# Altium schematic sheet Power input.SchDoc: Name project title here
size A3; Organization: Krakul OÜ; Address1: Kaare tee 3, lubja; Address2: viimsi vald; Address3: harju maakond; Address4: Estonia 74010; DocumentNumber: No here; Revision: 0; SheetNumber: 4; SheetTotal: 7
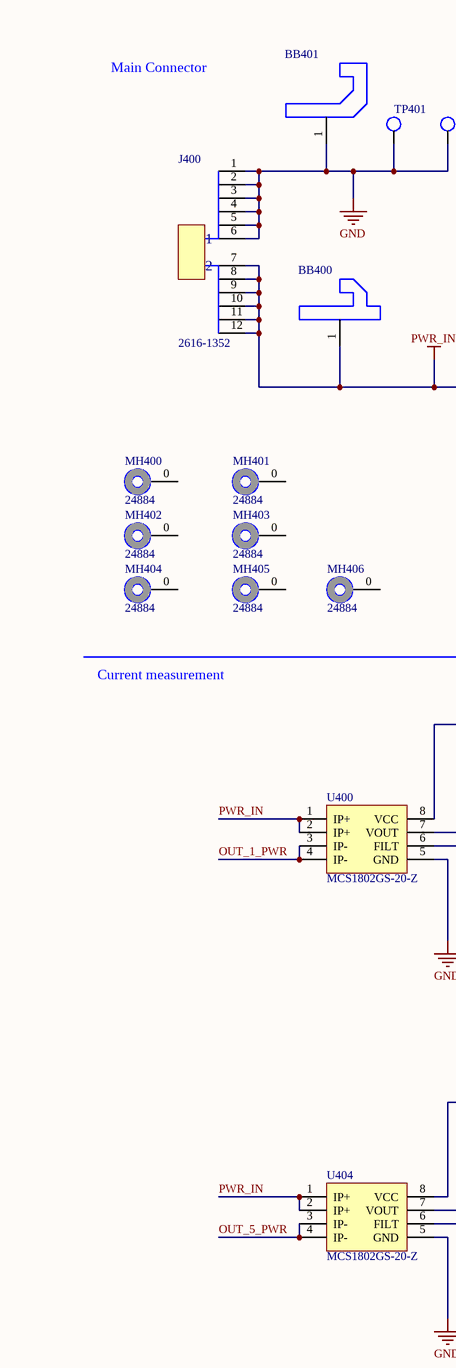
[diagram p0: Power input.SchDoc, left]
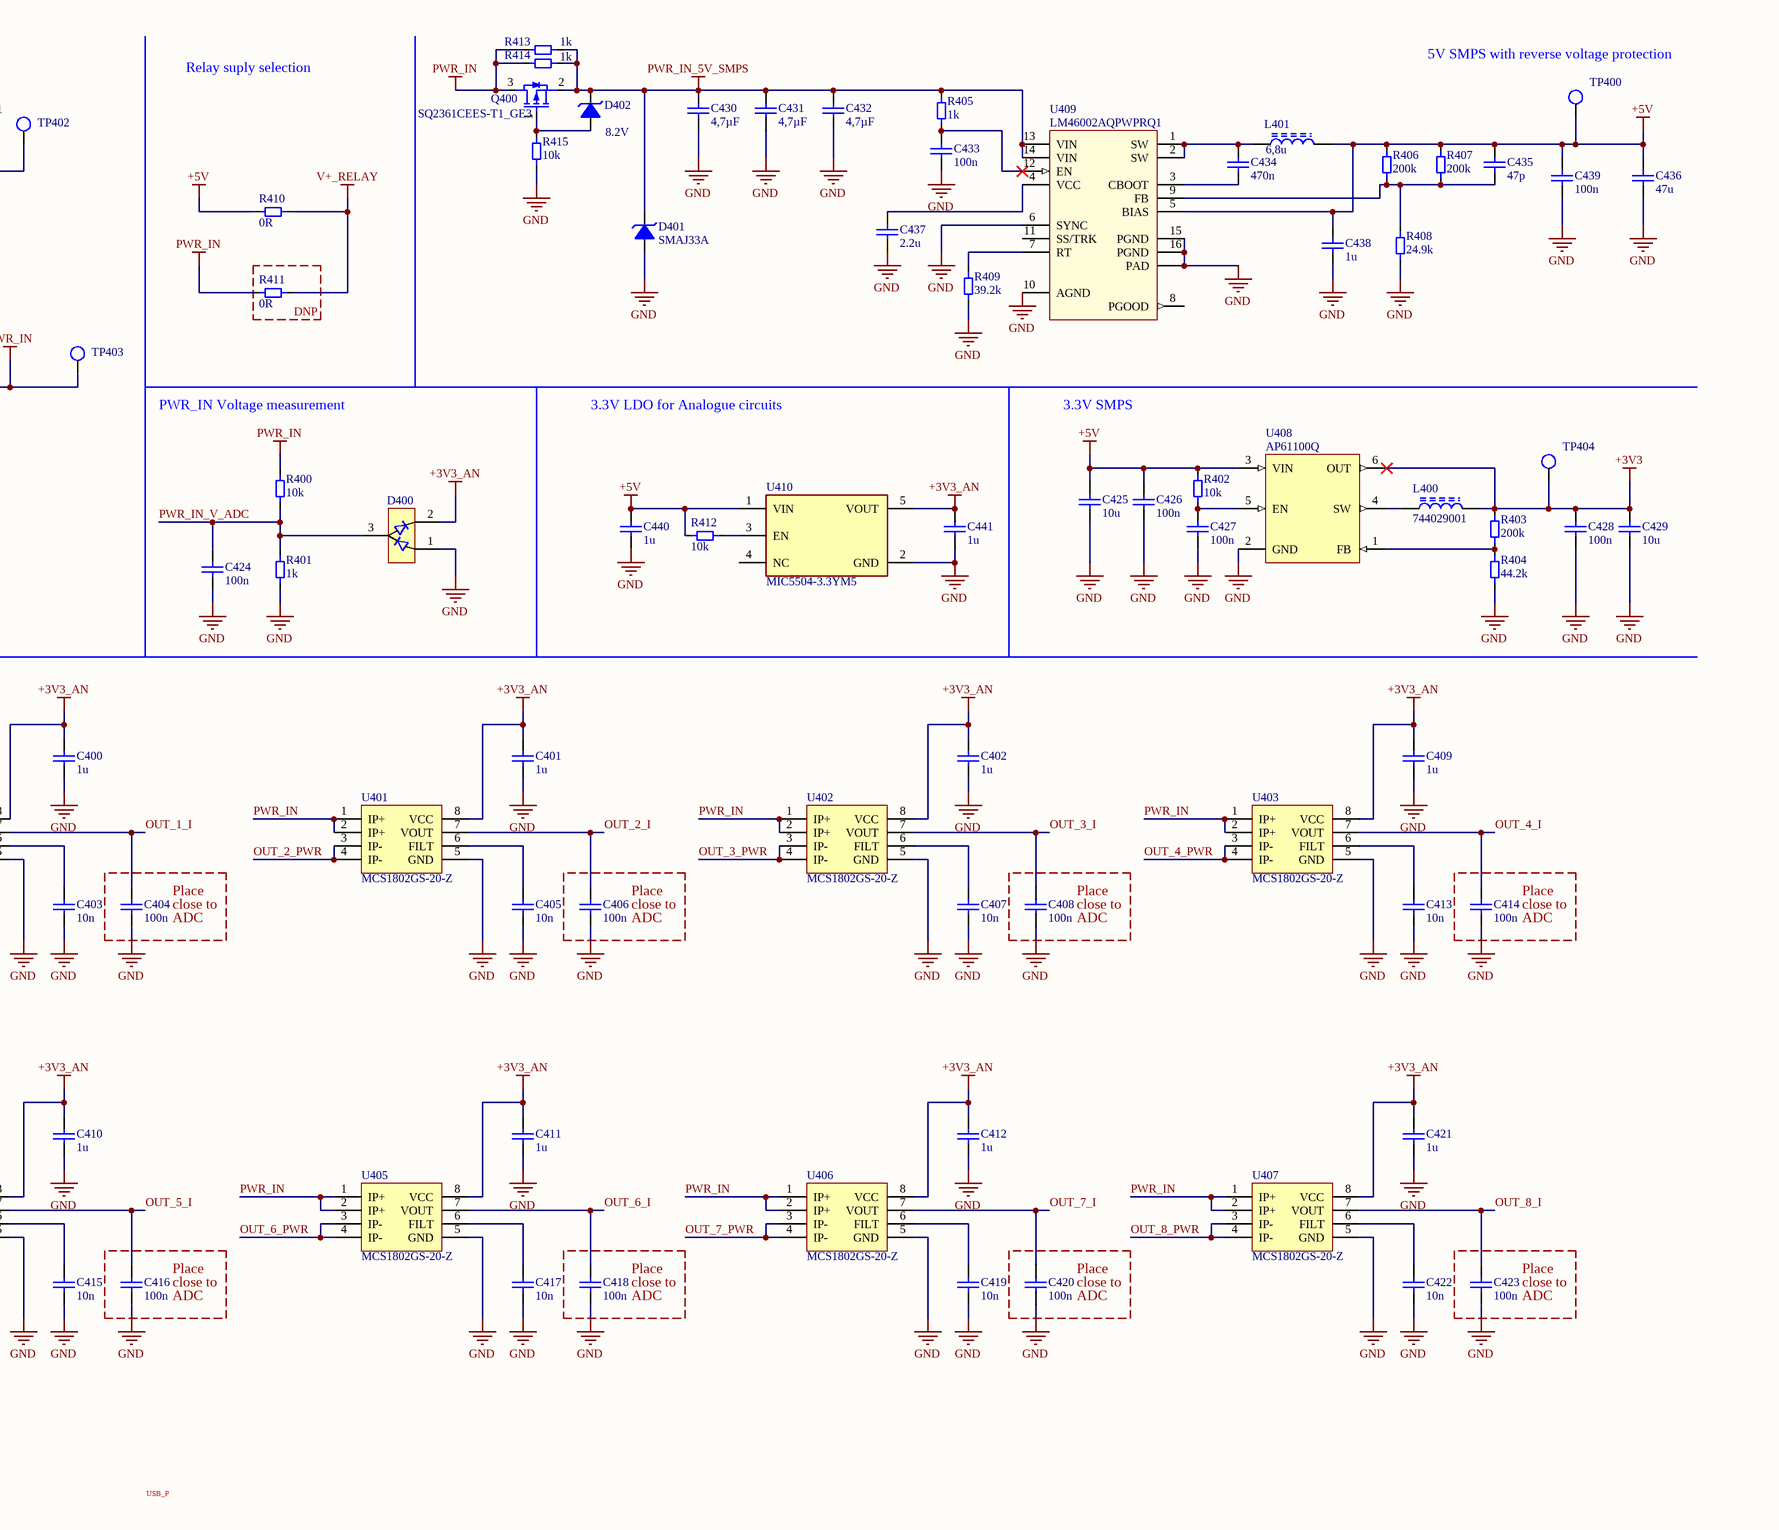
[diagram p1: Power input.SchDoc, right]

## Parts
BB400  Kr-Df-01 PWR BUSBAR  [Kr-Df-01 PWR BUSBAR footprint]  (value not drawn)
BB401  KR-Df-01 GND BUSBAR  [KR-Df-01 GND BUSBAR-Footprint-1]  (value not drawn)
C400  1u  [MLCC_0603_M]
C401  1u  [MLCC_0603_M]
C402  1u  [MLCC_0603_M]
C403  10n  [MLCC_0402_M]
C404  100n  [MLCC_0402_M]
C405  10n  [MLCC_0402_M]
C406  100n  [MLCC_0402_M]
C407  10n  [MLCC_0402_M]
C408  100n  [MLCC_0402_M]
C409  1u  [MLCC_0603_M]
C410  1u  [MLCC_0603_M]
C411  1u  [MLCC_0603_M]
C412  1u  [MLCC_0603_M]
C413  10n  [MLCC_0402_M]
C414  100n  [MLCC_0402_M]
C415  10n  [MLCC_0402_M]
C416  100n  [MLCC_0402_M]
C417  10n  [MLCC_0402_M]
C418  100n  [MLCC_0402_M]
C419  10n  [MLCC_0402_M]
C420  100n  [MLCC_0402_M]
C421  1u  [MLCC_0603_M]
C422  10n  [MLCC_0402_M]
C423  100n  [MLCC_0402_M]
C424  100n  [MLCC_0402_M]
C425  10u  [MLCC_0603_M]
C426  100n  [MLCC_0402_M]
C427  100n  [MLCC_0402_M]
C428  100n  [MLCC_0402_M]
C429  10u  [MLCC_0603_M]
C430  value 4,7µF  [MLCC_1210_M]  (hidden comment: 4.7u)
C431  value 4,7µF  [MLCC_1210_M]  (hidden comment: 4.7u)
C432  value 4,7µF  [MLCC_1210_M]  (hidden comment: 4.7u)
C433  100n  [MLCC_0402_M]
C434  470n  [MLCC_0402_M]
C435  47p  [MLCC_0402_M]
C436  47u  [MLCC_1206_M]
C437  2.2u  [MLCC_0603_M]
C438  1u  [MLCC_0603_M]
C439  100n  [MLCC_0402_M]
C440  1u  [MLCC_0603_M]
C441  1u  [MLCC_0603_M]
D400  BAT6404WH6327XTSA1  [SOT323, SC70]  (value not drawn)
D401  SMAJ33A  [FP-SMAJ-MFG]
D402  Zener Voltage: 8.2V  [SOD-323]  (hidden comment: MM3Z8V2ST1G)
J400  2616-1352  [2616-1352-Footprint-1]
L400  744029001  [744029001]
L401  value 6,8u  [SRP0420-6R8K-Footprint-1]  (hidden comment: SRP0420-6R8K)
MH400  24884  [24884-Footprint-1]
MH401  24884  [24884-Footprint-1]
MH402  24884  [24884-Footprint-1]
MH403  24884  [24884-Footprint-1]
MH404  24884  [24884-Footprint-1]
MH405  24884  [24884-Footprint-1]
MH406  24884  [24884-Footprint-1]
Q400  SQ2361CEES-T1_GE3  [3-CPH]
R400  10k  [Resistor_0603_M]
R401  1k  [Resistor_0603_M]
R402  10k  [Resistor_0603_M]
R403  200k  [Resistor_0603_M]
R404  44.2k  [Resistor_0603_M]
R405  1k  [Resistor_0402_M]
R406  200k  [Resistor_0603_M]
R407  200k  [Resistor_0603_M]
R408  24.9k  [Resistor_0402_M]
R409  39.2k  [Resistor_0402_M]
R410  Value 2: 0R  [TLRZ2BTTD-Footprint-1]  (hidden comment: TLRZ2BTTD)
R411  Value 2: 0R  [TLRZ2BTTD-Footprint-1]  (hidden comment: TLRZ2BTTD)
R412  10k  [Resistor_0603_M]
R413  1k  [Resistor_0402_M]
R414  1k  [Resistor_0402_M]
R415  10k  [Resistor_0603_M]
TP400  Testpoint 1mm  [Testpoint 1mm]  (value not drawn)  (no BOM)
TP401  Testpoint 1mm  [Testpoint 1mm]  (value not drawn)  (no BOM)
TP402  Testpoint 1mm  [Testpoint 1mm]  (value not drawn)  (no BOM)
TP403  Testpoint 1mm  [Testpoint 1mm]  (value not drawn)  (no BOM)
TP404  Testpoint 1mm  [Testpoint 1mm]  (value not drawn)  (no BOM)
U400  MCS1802GS-20-Z  [MCS1802GS-20-Z -Footprint-1]
U401  MCS1802GS-20-Z  [MCS1802GS-20-Z -Footprint-1]
U402  MCS1802GS-20-Z  [MCS1802GS-20-Z -Footprint-1]
U403  MCS1802GS-20-Z  [MCS1802GS-20-Z -Footprint-1]
U404  MCS1802GS-20-Z  [MCS1802GS-20-Z -Footprint-1]
U405  MCS1802GS-20-Z  [MCS1802GS-20-Z -Footprint-1]
U406  MCS1802GS-20-Z  [MCS1802GS-20-Z -Footprint-1]
U407  MCS1802GS-20-Z  [MCS1802GS-20-Z -Footprint-1]
U408  AP61100Q  [SOT-5X3]
U409  LM46002AQPWPRQ1  [HTSSOP-16]
U410  MIC5504-3.3YM5  [FP-SOT23-5LD-PL-1-IPC_A]

## Blocks framed on the sheet
DNP: R411

## Nets
+3V3: C428.2 C429.2 L400.2 R403.2 TP404.1 U408.6(OUT)
+3V3_AN: C400.2 C401.2 C402.2 C409.2 C410.2 C411.2 C412.2 C421.2 C441.2 D400.2 U400.8(VCC) U401.8(VCC) U402.8(VCC) U403.8(VCC) U404.8(VCC) U405.8(VCC) U406.8(VCC) U407.8(VCC) U410.5(VOUT)
+5V: C425.2 C426.2 C435.2 C436.2 C438.2 C439.2 C440.2 L401.2 R402.2 R406.2 R407.2 R410.2 R412.2 TP400.1 U408.3(VIN) U409.5(BIAS) U410.1(VIN)
GND: BB401.1(GND) C400.1 C401.1 C402.1 C403.1 C404.1 C405.1 C406.1 C407.1 C408.1 C409.1 C410.1 C411.1 C412.1 C413.1 C414.1 C415.1 C416.1 C417.1 C418.1 C419.1 C420.1 C421.1 C422.1 C423.1 C424.1 C425.1 C426.1 C427.1 C428.1 C429.1 C430.2 C431.2 C432.2 C433.2 C436.1 C437.1 C438.1 C439.1 C440.1 C441.1 D400.1 D401.2(A) J400.1 J400.2 J400.3 J400.4 J400.5 J400.6 R401.1 R404.1 R408.1 R409.1 R415.1 TP401.1 TP402.1 U400.5(GND) U401.5(GND) U402.5(GND) U403.5(GND) U404.5(GND) U405.5(GND) U406.5(GND) U407.5(GND) U408.2(GND) U409.6(SYNC) U409.10(AGND) U409.15(PGND) U409.16(PGND) U409.17(PAD) U410.2(GND)
PWR_IN: BB400.1 J400.7 J400.8 J400.9 J400.10 J400.11 J400.12 Q400.3(D) R400.2 R411.2 R413.2 R414.2 TP403.1 U400.1(IP+) U400.2(IP+) U401.1(IP+) U401.2(IP+) U402.1(IP+) U402.2(IP+) U403.1(IP+) U403.2(IP+) U404.1(IP+) U404.2(IP+) U405.1(IP+) U405.2(IP+) U406.1(IP+) U406.2(IP+) U407.1(IP+) U407.2(IP+)
PWR_IN_5V_SMPS: C430.1 C431.1 C432.1 D401.1(C) D402.1(C) Q400.2(S) R405.2 R413.1 R414.1 U409.13(VIN) U409.14(VIN)
V+_RELAY: R410.1 R411.1
OUT_1_I: C404.2 U400.7(VOUT)
OUT_1_PWR: U400.3(IP-) U400.4(IP-)
OUT_2_I: C406.2 U401.7(VOUT)
OUT_2_PWR: U401.3(IP-) U401.4(IP-)
OUT_3_I: C408.2 U402.7(VOUT)
OUT_3_PWR: U402.3(IP-) U402.4(IP-)
OUT_4_I: C414.2 U403.7(VOUT)
OUT_4_PWR: U403.3(IP-) U403.4(IP-)
OUT_5_I: C416.2 U404.7(VOUT)
OUT_5_PWR: U404.3(IP-) U404.4(IP-)
OUT_6_I: C418.2 U405.7(VOUT)
OUT_6_PWR: U405.3(IP-) U405.4(IP-)
OUT_7_I: C420.2 U406.7(VOUT)
OUT_7_PWR: U406.3(IP-) U406.4(IP-)
OUT_8_I: C423.2 U407.7(VOUT)
OUT_8_PWR: U407.3(IP-) U407.4(IP-)
PWR_IN_V_ADC: C424.2 D400.3 R400.1 R401.2
NetC403_2: C403.2 U400.6(FILT)
NetC405_2: C405.2 U401.6(FILT)
NetC407_2: C407.2 U402.6(FILT)
NetC413_2: C413.2 U403.6(FILT)
NetC415_2: C415.2 U404.6(FILT)
NetC417_2: C417.2 U405.6(FILT)
NetC419_2: C419.2 U406.6(FILT)
NetC422_2: C422.2 U407.6(FILT)
NetC427_2: C427.2 R402.1 U408.5(EN)
NetC433_1: C433.1 R405.1 U409.12(EN)
NetC434_1: C434.1 U409.3(CBOOT)
NetC434_2: C434.2 L401.1 U409.1(SW) U409.2(SW)
NetC435_1: C435.1 R406.1 R407.1 R408.2 U409.9(FB)
NetC437_2: C437.2 U409.4(VCC)
NetD402_2: D402.2(A) Q400.1(G) R415.2
NetL400_1: L400.1 U408.4(SW)
NetR403_1: R403.1 R404.2 U408.1(FB)
NetR409_2: R409.2 U409.7(RT)
NetR412_1: R412.1 U410.3(EN)

Not connected (* = marked no-connect by the designer): MH400 0(MH?); MH401 0(MH?); MH402 0(MH?); MH403 0(MH?); MH404 0(MH?); MH405 0(MH?); MH406 0(MH?); U409 8(PGOOD) 11(SS/TRK); U410 4(NC)

## Notes on the sheet
- Main Connector
- Relay suply selection
- (near TP400) 5V SMPS with reverse voltage protection
- PWR_IN Voltage measurement
- 3.3V LDO for Analogue circuits
- 3.3V SMPS
- Current measurement
- (near C404) Place
- (near C404) close to
- (near C404) ADC
- (near C406) Place
- (near C406) close to
- (near C406) ADC
- (near C408) Place
- (near C408) close to
- (near C408) ADC
- (near C414) Place
- (near C414) close to
- (near C414) ADC
- (near C416) Place
- (near C416) close to
- (near C416) ADC
- (near C418) Place
- (near C418) close to
- (near C418) ADC
- (near C420) Place
- (near C420) close to
- (near C420) ADC
- (near C423) Place
- (near C423) close to
- (near C423) ADC
- USB_P
- Title:
- Date:
- Last modified:
- Project:
- Sheet
- Time:
- of
- Size:
- A3
- Engineer:
- Revision:
- Revision date:
- Checked by:

## Library data of the parts
BB400 = CMP-ROOT-01072-9: Custom PWR busbar for DefSecIntel fuse board.; Manufacturer: Krakul; Part number: PWR_BUSBAR_1; Case/Package: Custom busbar; Mount: SMD; Pins: 1; RoHS: Yes
BB401 = CMP-ROOT-01092-5: Custom GND busbar for DefSecIntel fuse board; Manufacturer: Krakul; Part number: GND_BUSBAR_1; Case/Package: Custom busbar; Mount: SMD; Pins: 1; RoHS: Yes
C400-C402 C409-C412 C421 C438 C440 C441 = CMP-001-0642-2: MLCC, 0603, 1u, 10%, 10V, X7R; Manufacturer: Any; Capacitor Type: Ceramic; Value: 1µF; Mount: SMD; Tolerance: 10%; Case/Package: 0603; Part number: MLCC, 0603, 1u, 10%, 10V, X7R; RoHS: Yes; Voltage: 10V; Dielectric: X7R
C403 C405 C407 C413 C415 C417 C419 C422 = CMP-0001-00209-2: MLCC, 0402, 10n, 10%, 50V, X5R; Manufacturer: Any; Value: 10nF; Capacitor Type: Ceramic; Dielectric: X5R; Case/Package: 0402; Mount: SMD; Voltage: 50V; Part number: MLCC, 0402, 10n, 10%, 50V, X5R; Tolerance: 10%; RoHS: Yes
C404 C406 C408 C414 C416 C418 C420 C423 C424 C426-C428 C439 = CMP-001-1256-2: MLCC, 0402, 100n, 10%, 10V, X5R; Manufacturer: Any; Capacitor Type: Ceramic; Value: 100nF; Case/Package: 0402; Part number: MLCC, 0402, 100n, 10%, 10V, X5R; RoHS: Yes; Tolerance: 10%; Mount: SMD; Voltage: 10V; Dielectric: X5R
C425 C429 = CMP-001-1355-1: MLCC, 0603, 10u, 10%, 25V, X5R; Manufacturer: Any; Value: 10µF; Capacitor Type: Ceramic; Voltage: 25V; Dielectric: X5R; Case/Package: 0603; Part number: MLCC, 0603, 10u, 10%, 25V, X5R; RoHS: Yes; Mount: SMD
C430-C432 = CMP-001-1296-1: MLCC, 1210, 4.7u, 10%, 100V, X7S; Manufacturer: Any; Capacitor Type: Ceramic; Capacitance: 4.7uF; Voltage Rating: 100V; Case Code (Metric): 3225; Case/Package: 1210; Min Operating Temperature: -55°C; Voltage: 100V; Mount: Surface Mount; Tolerance: 10%; Part number: MLCC, 1210, 4.7u, 10%, 100V, X7S; Packaging: Tape and Reel; Case Code (Imperial): 1210; RoHS: Yes; Dielectric: X7S; Max Operating Temperature: 125°C
C433 = CMP-0001-00196-2: MLCC, 0402, 100n, 10%, 50V, X7R; Manufacturer: Any; Value: 100nF; Capacitor Type: Ceramic; Part number: MLCC, 0402, 100n, 10%, 50V, X7R; Mount: SMD; Voltage: 50V; RoHS: Yes; Dielectric: X7R; Tolerance: 10%; Case/Package: 0402
C434 = CMP-0001-00217-2: MLCC, 0402, 470n, 10%, 50V, X5R; Manufacturer: Any; Capacitor Type: Ceramic; Value: 470nF; Dielectric: X5R; Mount: SMD; RoHS: Yes; Case/Package: 0402; Part number: MLCC, 0402, 470n, 10%, 50V, X5R; Voltage: 50V; Tolerance: 10%
C435 = CMP-0001-00149-2: MLCC, 0402, 47p, 10%, 50V, X7R; Manufacturer: Any; Capacitor Type: Ceramic; Value: 47pF; Tolerance: 10%; Case/Package: 0402; Dielectric: X7R; Mount: SMD; Voltage: 50V; RoHS: Yes; Part number: MLCC, 0402, 47p, 10%, 50V, X7R
C436 = CMP-001-1106-2: MLCC, 1206, 47u, 10%, 10V, X5R; Manufacturer: Any; Value: 47µF; Capacitor Type: Ceramic; Dielectric: X5R; Mount: SMD; Part number: MLCC, 1206, 47u, 10%, 10V, X5R; Tolerance: 10%; RoHS: Yes; Case/Package: 1206; Voltage: 10V
C437 = CMP-001-1459-1: MLCC, 0603, 2.2u, 10%, 16V, X5R; Manufacturer: Any; Capacitor Type: Ceramic; Value: 2.2µF; RoHS: Yes; Dielectric: X5R; Part number: MLCC, 0603, 2.2u, 10%, 16V, X5R; Case/Package: 0603; Tolerance: 10%; Voltage: 16V; Mount: SMD
D400 = CMP-ROOT-00071-1: Diode Array 1 Pair Series Connection Schottky 40V 120mA Surface Mount SC-70, SOT-323; Manufacturer: Infineon; Peak Non-Repetitive Surge Current: 800mA; Forward Current: 250mA; Forward Voltage: 750mV; Reverse Recovery Time: 5ns; RoHS: Yes; Radiation Hardening: No; Halogen Free: Halogen Free; Case/Package: SOT-323; Number of Pins: 3; Max Reverse Voltage (DC): 40V; Max Repetitive Reverse Voltage (Vrrm): 40V; Mount: Surface Mount; Average Rectified Current: 120mA; Max Operating Temperature: 150°C; Lead Free: Lead Free; Min Operating Temperature: -55°C; Part number: BAT6404WH6327XTSA1; Packaging: Tape and Reel; Pins: 3
D401 = CMP-ROOT-01076-1: SMAJ Series 53.3 V 0.4 kW Surface Mount Uni-Directional TVS Diode - DO-214AC; Manufacturer: Littelfuse; Clamping Voltage: 53.3V; Diode Type: ZENER; Direction: Unidirectional; Leakage Current: 1uA; Max Breakdown Voltage: 40.6V; Max Power Dissipation: 3.3W; Min Breakdown Voltage: 36.7V; Number of Elements: 1; Peak Pulse Current: 7.5A; Peak Pulse Power: 400W; Power Line Protection: No; Reverse Standoff Voltage: 33V; Test Current: 1mA; Case/Package: DO-214AC; Mount: SMD; Part number: SMAJ33A; Pins: 2; RoHS: Yes; Clamping Voltage-Max: 53.3V; Height: 2.087mm; Lead Free: Lead Free; Length: 4.5mm; Max Operating Temperature: 150°C; Max Reverse Leakage Current: 1uA; Min Operating Temperature: -65°C; Mounting Technology: Surface Mount; Number of Unidirectional Channels: 1; Packaging: Tape and Reel; Polarity: Unidirectional; Power Dissipation: 400W; Reach SVHC Compliant: Unknown; Reverse Breakdown Voltage: 36.7V; RoHS Compliant: Yes; Series: SMAJ; Voltage Rating (DC): 33V; Width: 2.79mm
D402 = CMP-ROOT-00931-1: MM3Z8V2ST1 Series 200 mW 10 mA 8.2 V SMT Zener Voltage Regulator - SOD-323; Manufacturer: onsemi; Element Configuration: Single; Forward Voltage: 900mV; Impedance: 15R; Material: Plastic; Max Power Dissipation: 200mW; Max Reverse Current: 700nA; Test Current: 5mA; Tolerance: 2%; Zener Current: 10mA; Case/Package: SOD-323-2; Mount: SMD; Part number: MM3Z8V2ST1G; RoHS: Yes; Height: 1mm; Lead Free: Lead Free; Length: 1.8mm; Max Operating Temperature: 150°C; Max Reverse Leakage Current: 700nA; Min Operating Temperature: -65°C; Number of Pins: 2; Package Quantity: 3000; Packaging: Tape and Reel; Power Dissipation: 200mW; Power Rating: 200mW; Radiation Hardening: No; Reach SVHC Compliant: Yes; RoHS Compliant: Yes; Series: -; Voltage Rating (DC): 8.2V; Voltage Tolerance: 2%; Width: 1.35mm; Working Voltage: 8.2V
J400 = CMP-ROOT-01061-1: Lever actuated terminal block, Wire-to-board. 78A, 300V, 4-18 AWG; Manufacturer: WAGO; Mount: TH; Part number: 2616-1352; Pins: 2; RoHS: Yes; Housing Color: Grey
L400 = CMP-ROOT-00305-1: 1µH Shielded Wirewound Inductor 2.2A 55mOhm Max Nonstandard; Manufacturer: Wurth Electronics Inc.; DC Resistance (DCR): 55mR; Inductance: 1uH; Value: 1uH; Test Frequency: 100kHz; Inductance Tolerance: 30%; Saturation Current: 1.6A; Self Resonant Frequency: 150MHz; Core Material: Ferrite; Max DC Current: 2.5A; RoHS: Yes; Number of Pins: 2; Width: 2.8mm; Height: 1.35mm; Length: 2.8mm; Current Rating: 2.2A; Termination: SMD/SMT; Packaging: Cut Tape; Height - Seated (Max): 0.059inch; Part number: 744029001; Composition: Wirewound; Case/Package: Nonstandard; Depth: 2.8mm; Mount: Surface Mount; REACH SVHC: Unknown; RMS Current (Irms): 2.2A; Package Quantity: 1200; Weight: 0.001129oz; Max Operating Temperature: 125°C; Min Operating Temperature: -40°C; Tolerance: 30%; Shielding: Shielded
L401 = CMP-ROOT-01075-2: Inductor Power Shielded Wirewound 6.8uH 10% 100KHz 27Q-Factor Metal Alloy Powder 2.6A 0.117Ohm DCR T/R; Manufacturer: Bourns; Case/Package: 4x4mm; Mount: SMD; Part number: SRP0420-6R8K; Pins: 2; RoHS: Yes
MH400-MH406 = CMP-ROOT-01125-5: Standoffs & Spacers SM Standoff Steel 650 pcs per reel; Manufacturer: Keystone Electronics; Plating: Tin; Threaded/Unthreaded: Threaded; Case/Package: -; Mount: SMD; Part number: 24884; RoHS: Yes; Material: Steel; Series: -
Q400 = CMP-ROOT-01117-1: P-Channel 60V 2,8A SOT-23-3; Manufacturer: Vishay; Case/Package: SOT-23-3; Mount: SMD; Part number: SQ2361CEES-T1_GE3; Pins: 3; RoHS: Yes
R400 R402 R412 R415 = CMP-001-0101-2: Resistor, 0603, 10k, 1%, 1/10W; Manufacturer: Any; Power: 100mW; Tolerance: 1%; Value: 10k; RoHS: Yes; Mount: SMD; Case/Package: 0603; Part number: Resistor, 0603, 10k, 1%, 1/10W
R401 = CMP-0001-00237-1: Resistor, 0603, 1k, 0.1%, 1/16W; Manufacturer: Any; Mount: SMD; Part number: Any; RoHS: Yes; Case/Package: 0603; Value: 1k
R403 R406 R407 = CMP-001-0132-2: Resistor, 0603, 200k, 1%, 1/10W; Manufacturer: Any; Power: 100mW; Case/Package: 0603; Mount: SMD; Part number: Resistor, 0603, 200k, 1%, 1/10W; Value: 200k; RoHS: Yes; Tolerance: 1%
R404 = CMP-001-1616-1: Resistor, 0603, 44.2k, 0.1%, 1/10W; Manufacturer: Any; Power: 100mW; RoHS: Yes; Case/Package: 0603; Mount: SMD; Value: 44.2k; Part number: Resistor, 0603, 44.2k, 0.1%, 1/10W; Tolerance: 0.1%
R405 R413 R414 = CMP-001-0340-2: Resistor, 0402, 1k, 1%, 1/16W; Manufacturer: Any; Power: 62mW; Value: 1k; Case/Package: 0402; Mount: SMD; Tolerance: 1%; RoHS: Yes; Part number: Resistor, 0402, 1k, 1%, 1/16W
R408 = CMP-0001-00027-1: Resistor, 0402, 24.9k, 1%, 1/10W; Manufacturer: Any; Case/Package: 0402; Mount: SMD; RoHS: Yes; Part number: Any; Value: 24.9k
R409 = CMP-0001-00015-2: Resistor, 0402, 39.2k, 1%, 1/10W; Manufacturer: Any; Case/Package: 0402; Value: 39.2k; Mount: SMD; Part number: Resistor, 0402, 39.2k, 1%, 1/10W; RoHS: Yes
R410 R411 = CMP-0001-00276-2: Res Metal Plate 1206 0 Ohm Sulfur Resistant Pad SMD Automotive T/R; Manufacturer: KOA Speer Electronics; Current: 50A; Value: 0; Case/Package: 1206; Mount: SMD; Part number: TLRZ2BTTD; Pins: 2; RoHS: Yes; Case Code (Imperial): 1206; Case Code (Metric): 3216; Features: Automotive AEC-Q200; Max Operating Temperature: 170°C; Min Operating Temperature: -55°C; Number of Terminations: 2; Packaging: Cut Tape; Ratings: AEC-Q200; RoHS Compliant: Yes; Series: TLRZ
TP400-TP404 = CMP-001-1238-1
U400-U407 = CMP-ROOT-01063-2: Hall Effect-Based Linear Current Sensor IC ±20A 66mV/A 100kHz 8-Pin SOIC T/R; Manufacturer: MPS; Case/Package: SOIC-8; Mount: SMD; Part number: MCS1802GS-20-Z; Pins: 8; RoHS: Yes; Sensitivity: 66mV/A
U408 = CMP-ROOT-00784-1: Switching Voltage Regulators DCDC Conv LV Buck SOT563 T&R 3K; Part number: AP61102Z6-7; Manufacturer: Diodes Incorporated; Mount: SMD; Case/Package: SOT-563-6; RoHS: Yes
U409 = CMP-ROOT-00198-2: Manufacturer: Texas Instruments; Min Output Voltage: 1V; Min Input Voltage: 3.5V; Output Type: Adjustable; Output Current: 2A; Number of Outputs: 1; Switching Frequency: 2.2MHz; Max Input Voltage: 60V; Synchronous Rectifier: Yes; Output Configuration: Positive; Max Output Voltage: 28V; Packaging: Tape and Reel; Min Operating Temperature: -40°C; RoHS: Yes; Part number: LM46002AQPWPRQ1; Pins: 16; Mount: Surface Mount; Case/Package: 16HTSSOP; Max Operating Temperature: 125°C
U410 = CMP-ROOT-00999-4: 3.3V 300mA LDO; Manufacturer: Microchip Technology; Case/Package: SOT23-5; Mount: SMD; Part number: MIC5504-3.3YM5; Pins: 5; RoHS: Yes